# EAGLE schematic untitled (EAGLE 6.6.0)
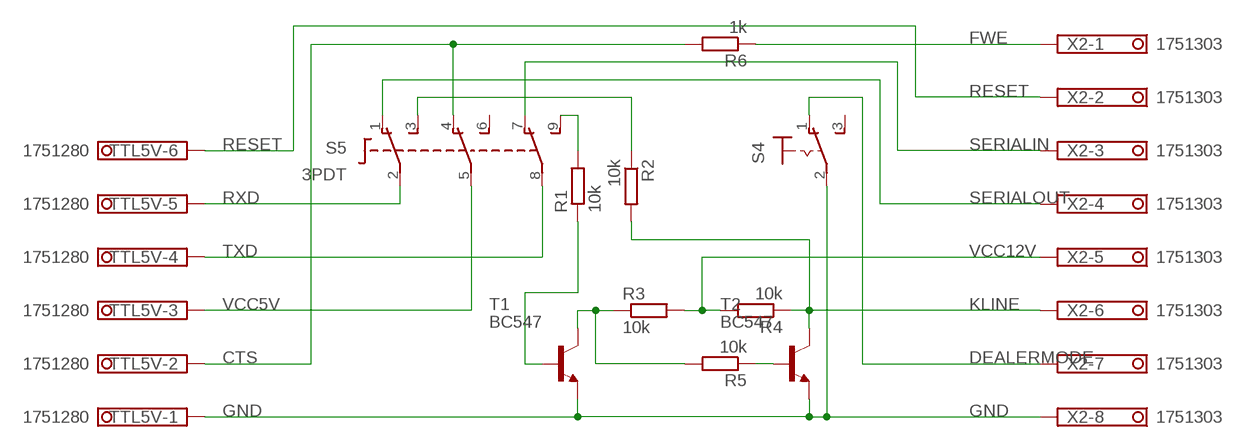
[diagram p0: schematic, sheet 1]

## Parts
R1  10k  R-EU_0207/10  [0207/10]
R2  10k  R-EU_0207/10  [0207/10]
R3  10k  R-EU_0207/10  [0207/10]
R4  10k  R-EU_0207/10  [0207/10]
R5  10k  R-EU_0207/10  [0207/10]
R6  1k  R-EU_0207/10  [0207/10]
S4  320-916  [320-916]
S5  3PDT  [3PDT]
T1  BC547  [TO92]
T2  BC547  [TO92]
TTL5V  1751280  [1751280]
X2  1751303  [1751303]

## Nets
CTS: R6.2 TTL5V.2
DEALERMODE: S4.1(O) X2.7
FWE: R6.1 X2.1
GND: S4.2(P) T1.1(E) T2.1(E) TTL5V.1 X2.8
KLINE: R2.2 R4.1 T2.3(C) X2.6
N$1: R1.2 S5.9(S3)
N$2: R1.1 T1.2(B)
N$9: R5.1 T2.2(B)
N$12: R2.1 S5.3(S1)
N$17: R3.1 R5.2 T1.3(C)
RESET: TTL5V.6 X2.2
RXD: S5.2(P1) TTL5V.5
SERIALIN: S5.7(O3) X2.3
SERIALOUT: S5.1(O1) X2.4
TXD: S5.8(P3) TTL5V.4
VCC5V: TTL5V.3
VCC12V: R3.2 R4.2 X2.5
Unconnected: S4.3(S) S5.4(O2) S5.5(P2) S5.6(S2)

## Library data of the parts
R1-R6 = resistor:R-EU_: RESISTOR, European symbol
S4 = switch:320-916: TOGGLE SWITCH distributor RS Components
S5 = switch:3PDT: 3PDT 9 pin footswitch SF17020F-0302-21R-L Source: 3PDT.jpg
T1 T2 = transistor:BC547: NPN TRANSISTOR
TTL5V = con-phoenix-350:1751280: MKDS 1/ 6-3,5 Printklemme Nennstrom: 10 A Bemessungsspannung: 160 V Raster: 3,5 mm Polzahl: 6 Montageart: Löten Anschlussart: Schraubanschluss Anschlussrichtung vom Leiter zur Platine: 0° Source: http://eshop.phoenixcontact.com .. 1751280.pdf; MPN: 1751280; OC_FARNELL: unknown; OC_NEWARK: 27R1765
X2 = con-phoenix-350:1751303: MKDS 1/ 8-3,5 Printklemme Nennstrom: 10 A Bemessungsspannung: 160 V Raster: 3,5 mm Polzahl: 8 Montageart: Löten Anschlussart: Schraubanschluss Anschlussrichtung vom Leiter zur Platine: 0° Source: http://eshop.phoenixcontact.com .. .pdf; OC_FARNELL: unknown; OC_NEWARK: unknown